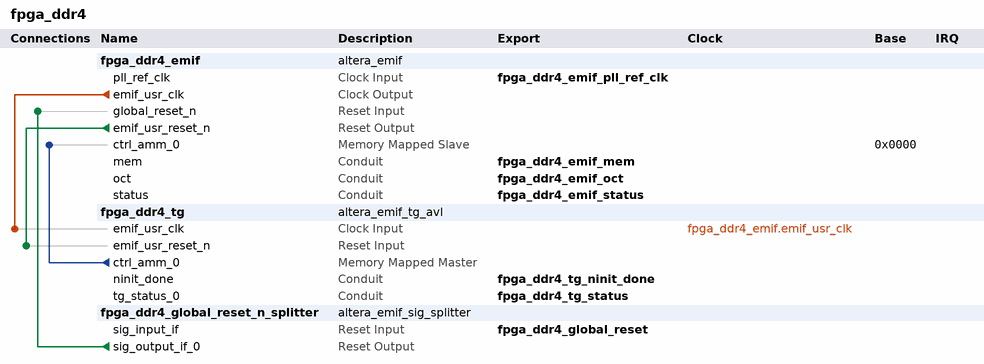
[diagram p0: system contents]
# Platform Designer (Qsys) system fpga_ddr4, Arria 10 10AS066H2F34I1HG
# Parameters at their usual value, and those the tool derives, are not listed.
package require -exact qsys 1.0
create_system fpga_ddr4
set_project_property DEVICE_FAMILY {Arria 10}
set_project_property DEVICE 10AS066H2F34I1HG

add_component fpga_ddr4_emif fpga_ddr4_emif.ip altera_emif fpga_ddr4_emif 19.1.0

add_component fpga_ddr4_tg fpga_ddr4_tg.ip altera_emif_tg_avl fpga_ddr4_tg 19.1

add_component fpga_ddr4_global_reset_n_splitter fpga_ddr4_global_reset_n_splitter.ip altera_emif_sig_splitter fpga_ddr4_global_reset_n_splitter 19.1

# connections
add_connection fpga_ddr4_emif.emif_usr_clk fpga_ddr4_tg.emif_usr_clk clock
add_connection fpga_ddr4_emif.emif_usr_reset_n fpga_ddr4_tg.emif_usr_reset_n reset
add_connection fpga_ddr4_global_reset_n_splitter.sig_output_if_0 fpga_ddr4_emif.global_reset_n reset
add_connection fpga_ddr4_tg.ctrl_amm_0 fpga_ddr4_emif.ctrl_amm_0 avalon
set_connection_parameter_value fpga_ddr4_tg.ctrl_amm_0/fpga_ddr4_emif.ctrl_amm_0 baseAddress 0x0000

# exported interfaces
add_interface fpga_ddr4_emif_mem conduit end
set_interface_property fpga_ddr4_emif_mem EXPORT_OF fpga_ddr4_emif.mem
add_interface fpga_ddr4_emif_oct conduit end
set_interface_property fpga_ddr4_emif_oct EXPORT_OF fpga_ddr4_emif.oct
add_interface fpga_ddr4_emif_pll_ref_clk clock sink
set_interface_property fpga_ddr4_emif_pll_ref_clk EXPORT_OF fpga_ddr4_emif.pll_ref_clk
add_interface fpga_ddr4_emif_status conduit end
set_interface_property fpga_ddr4_emif_status EXPORT_OF fpga_ddr4_emif.status
add_interface fpga_ddr4_global_reset reset sink
set_interface_property fpga_ddr4_global_reset EXPORT_OF fpga_ddr4_global_reset_n_splitter.sig_input_if
add_interface fpga_ddr4_tg_ninit_done conduit end
set_interface_property fpga_ddr4_tg_ninit_done EXPORT_OF fpga_ddr4_tg.ninit_done
add_interface fpga_ddr4_tg_status conduit end
set_interface_property fpga_ddr4_tg_status EXPORT_OF fpga_ddr4_tg.tg_status_0

save_system fpga_ddr4.qsys
